# Altium schematic sheet Camera Control.SchDoc
size A4; Version: V1.0  Rev A
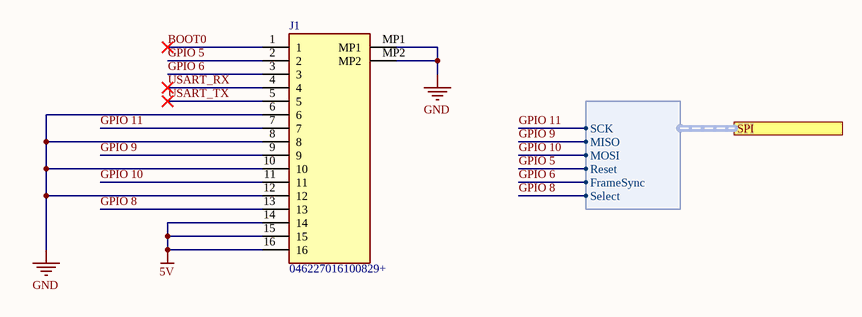
[diagram p0: Camera Control.SchDoc]

## Parts
J1  046227016100829+  [046227016100800]

## Ports
SPI (harness SPI)

## Harnesses
SPI: SCK, MISO, MOSI, Reset, FrameSync, Select

## Nets
5V: J1.14 J1.15 J1.16
GND: J1.6 J1.8 J1.10 J1.12 J1.MP1 J1.MP2
BOOT0: J1.1
GPIO 5: J1.2 ; port SPI.Reset
GPIO 6: J1.3 ; port SPI.FrameSync
GPIO 8: J1.13 ; port SPI.Select
GPIO 9: J1.9 ; port SPI.MISO
GPIO 10: J1.11 ; port SPI.MOSI
GPIO 11: J1.7 ; port SPI.SCK
USART_RX: J1.4
USART_TX: J1.5

## Notes on the sheet
- Title
- Size:
- Date:
- A4
- Version
- Sheet
- of
- DeepSea Developments
- Cll  2A # 24C - 25
- Cali, Valle del Cauca
- Colombia
- www.dsd.dev
- Proyect:

## Library data of the parts
J1 = 046227016100800+: Connector; Manufacturer_Name: Kyocera Electronic Components; Datasheet Link: https://componentsearchengine.com/Datasheets/1/046227016100800+.pdf; Height: 2mm; Manufacturer_Part_Number: 046227016100800+; Mouser Part Number: 581-046227016100800+; Mouser Price/Stock: https://www.mouser.com/Search/Refine.aspx?Keyword=581-046227016100800%2B